# Altium project altium_hier.PrjPcb
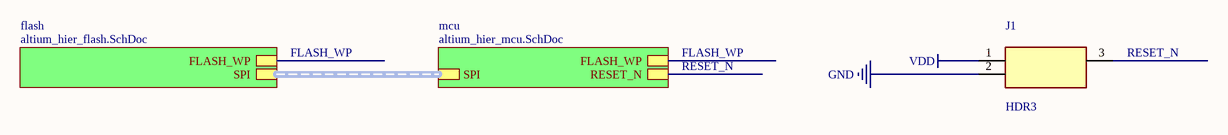
[diagram p0: altium_hier.SchDoc]
3 sheets, 6 parts. Net scope: hierarchical (ports join the sheet entries above them; power ports are global).
Sheets:
  altium_hier.SchDoc
    flash = altium_hier_flash.SchDoc
    mcu = altium_hier_mcu.SchDoc

## Sheet altium_hier.SchDoc
size A4

### Parts
J1  HDR3  [HDR1X3]

### Sub-sheets
flash = altium_hier_flash.SchDoc: FLASH_WP, SPI (harness SPI)
mcu = altium_hier_mcu.SchDoc: FLASH_WP, RESET_N, SPI (harness SPI)

### Nets
GND: J1.2
VDD: J1.1
FLASH_WP: sheet flash/FLASH_WP, sheet mcu/FLASH_WP
RESET_N: J1.3 ; sheet mcu/RESET_N

### Buses and harness runs
harness sheet flash/SPI = sheet mcu/SPI

## Sheet altium_hier_flash.SchDoc
size A4
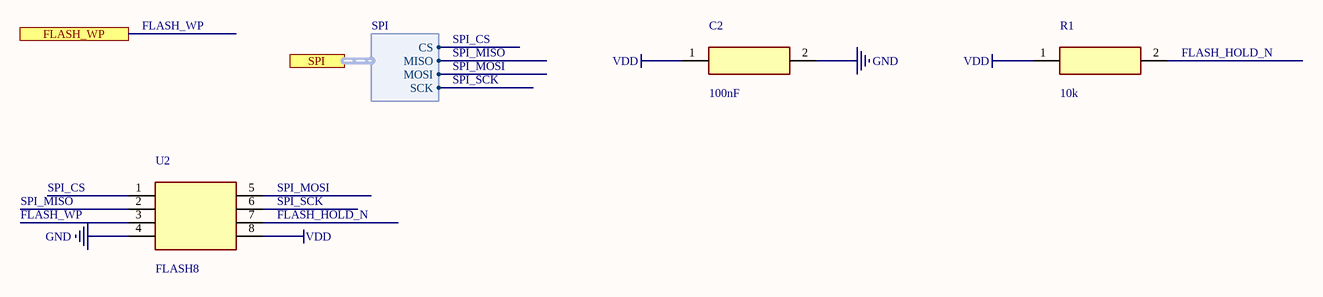
[diagram p1: altium_hier_flash.SchDoc]

### Parts
C2  100nF  [C0603]
R1  10k  [R0603]
U2  FLASH8  [SOIC8]

### Ports
FLASH_WP, SPI (harness SPI)

### Harnesses
SPI: CS, MISO, MOSI, SCK

### Nets
GND: C2.2 U2.4
VDD: C2.1 R1.1 U2.8
FLASH_HOLD_N: R1.2 U2.7
FLASH_WP: U2.3 ; port FLASH_WP
SPI_CS: U2.1 ; port SPI.CS
SPI_MISO: U2.2 ; port SPI.MISO
SPI_MOSI: U2.5 ; port SPI.MOSI
SPI_SCK: U2.6 ; port SPI.SCK

### Library data of the parts
C2 = CAP
R1 = RES

## Sheet altium_hier_mcu.SchDoc
size A4
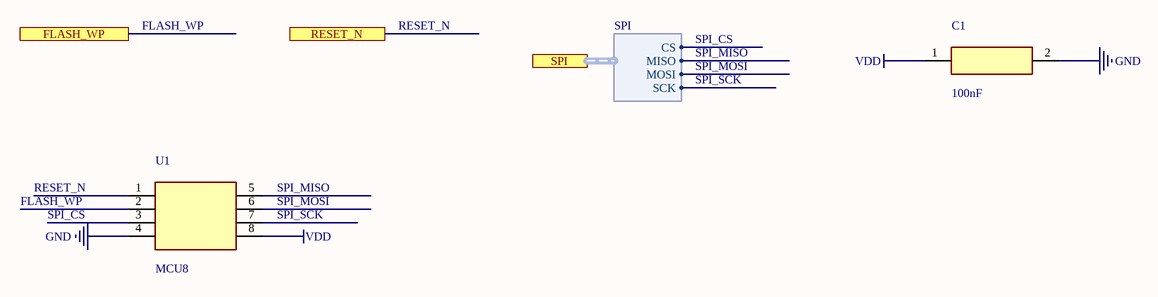
[diagram p2: altium_hier_mcu.SchDoc]

### Parts
C1  100nF  [C0603]
U1  MCU8  [SOIC8]

### Ports
FLASH_WP, RESET_N, SPI (harness SPI)

### Harnesses
SPI: CS, MISO, MOSI, SCK

### Nets
GND: C1.2 U1.4
VDD: C1.1 U1.8
FLASH_WP: U1.2 ; port FLASH_WP
RESET_N: U1.1 ; port RESET_N
SPI_CS: U1.3 ; port SPI.CS
SPI_MISO: U1.5 ; port SPI.MISO
SPI_MOSI: U1.6 ; port SPI.MOSI
SPI_SCK: U1.7 ; port SPI.SCK

### Library data of the parts
C1 = CAP

## Nets that join several sheets
GND: altium_hier (J1.2), altium_hier_flash (C2.2 U2.4), altium_hier_mcu (C1.2 U1.4)
VDD: altium_hier (J1.1), altium_hier_flash (C2.1 R1.1 U2.8), altium_hier_mcu (C1.1 U1.8)
FLASH_WP: altium_hier_flash (U2.3), altium_hier_mcu (U1.2)
RESET_N: altium_hier (J1.3), altium_hier_mcu (U1.1)
SPI_CS: altium_hier_flash (U2.1), altium_hier_mcu (U1.3)
SPI_MISO: altium_hier_flash (U2.2), altium_hier_mcu (U1.5)
SPI_MOSI: altium_hier_flash (U2.5), altium_hier_mcu (U1.6)
SPI_SCK: altium_hier_flash (U2.6), altium_hier_mcu (U1.7)